# Altium project Mixed Signal Board Project.PrjPcb (part 2 of 2)
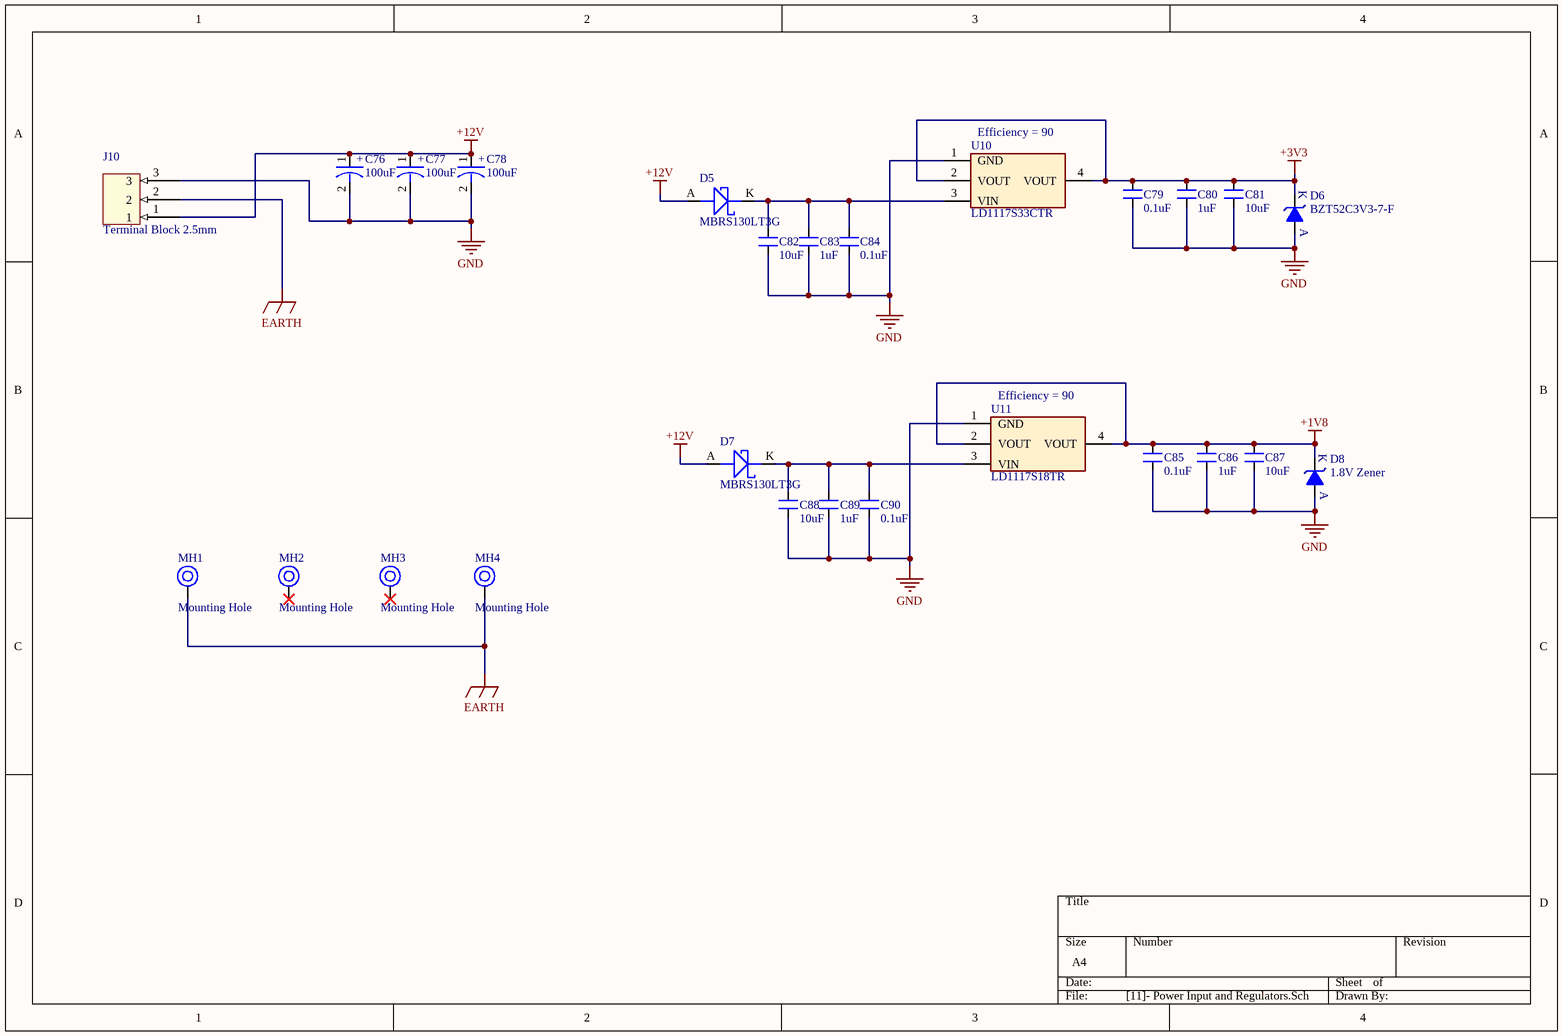
[diagram p11: [11]- Power Input and Regulators.SchDoc]

## Nets that join several sheets
+1V8: [8]-DAC and MIC (C36.2 C37.2 FB3.1 U6.34), [11]- Power Input and Regulators (6 pins)
+3V3: [3]- STM32F103 Debugger (14 pins), [4]- Ethernet PHY (10 pins), [5]- Motor Driver Schematic (R22.2), [6]-CH340C (C28.2 U4.4 U4.16), [7]- ADC Chip (8 pins), [8]-DAC and MIC (12 pins), [9]-STM32F407 Controller (20 pins), [10]-Motor Driver-2 (R43.2), [11]- Power Input and Regulators (6 pins)
+12V: [5]- Motor Driver Schematic (7 pins), [10]-Motor Driver-2 (6 pins), [11]- Power Input and Regulators (6 pins)
EARTH: [4]- Ethernet PHY (C21.2 R12.1), [11]- Power Input and Regulators (J10.2 MH1.1 MH4.1)
GND: [3]- STM32F103 Debugger (19 pins), [4]- Ethernet PHY (20 pins), [5]- Motor Driver Schematic (12 pins), [6]-CH340C (C28.1 J5.5 J5.6 U4.1), [7]- ADC Chip (10 pins), [8]-DAC and MIC (25 pins), [9]-STM32F407 Controller (28 pins), [10]-Motor Driver-2 (11 pins), [11]- Power Input and Regulators (20 pins)
CH340_RTS: [6]-CH340C (U4.14), [9]-STM32F407 Controller (U8.57)
CH340_RXD: [6]-CH340C (U4.3), [9]-STM32F407 Controller (U8.79)
CH340_TXD: [6]-CH340C (U4.2), [9]-STM32F407 Controller (U8.78)
CLK_MIC: [8]-DAC and MIC (U7.3), [9]-STM32F407 Controller (U8.65)
COL: [4]- Ethernet PHY (DS2.A U2.28), [9]-STM32F407 Controller (U8.26)
CRS: [4]- Ethernet PHY (DS1.A U2.29), [9]-STM32F407 Controller (U8.23)
DOUT_MIC: [8]-DAC and MIC (U7.4), [9]-STM32F407 Controller (U8.53)
DRDY: [7]- ADC Chip (U5.14), [9]-STM32F407 Controller (U8.56)
EN: [5]- Motor Driver Schematic (R23.1 U3.14), [9]-STM32F407 Controller (U8.45)
EN_2: [9]-STM32F407 Controller (U8.66), [10]-Motor Driver-2 (R44.1 U9.14)
JTCLK_F407: [3]- STM32F103 Debugger (U1.18), [9]-STM32F407 Controller (U8.76)
JTMS_F407: [3]- STM32F103 Debugger (U1.25 U1.27), [9]-STM32F407 Controller (U8.72)
LRCK: [8]-DAC and MIC (U6.40), [9]-STM32F407 Controller (U8.90)
MCLK: [8]-DAC and MIC (U6.37), [9]-STM32F407 Controller (U8.29)
MDC: [4]- Ethernet PHY (U2.12), [9]-STM32F407 Controller (U8.16)
MDIO: [4]- Ethernet PHY (R10.1 U2.11), [9]-STM32F407 Controller (U8.25)
nFAULT: [5]- Motor Driver Schematic (R21.1 U3.9), [9]-STM32F407 Controller (U8.62)
nFAULT_2: [9]-STM32F407 Controller (U8.59), [10]-Motor Driver-2 (R42.1 U9.9)
NTRST_F407: [3]- STM32F103 Debugger (U1.26), [9]-STM32F407 Controller (C55.2 R32.1 SW3.2 U8.14)
PH: [5]- Motor Driver Schematic (U3.15), [9]-STM32F407 Controller (U8.63)
PH_2: [9]-STM32F407 Controller (U8.60), [10]-Motor Driver-2 (U9.15)
PHY_RESET: [4]- Ethernet PHY (R7.1 SW2.2 U2.32), [9]-STM32F407 Controller (U8.64)
RESET: [7]- ADC Chip (R26.1 U5.3), [9]-STM32F407 Controller (U8.55)
RESET_DAC: [8]-DAC and MIC (R29.1 U6.32), [9]-STM32F407 Controller (U8.54)
RX_CLK: [4]- Ethernet PHY (U2.19), [9]-STM32F407 Controller (U8.24)
RX_D0: [4]- Ethernet PHY (U2.16), [9]-STM32F407 Controller (U8.33)
RX_D1: [4]- Ethernet PHY (U2.15), [9]-STM32F407 Controller (U8.34)
RX_D2: [4]- Ethernet PHY (U2.14), [9]-STM32F407 Controller (U8.35)
RX_D3: [4]- Ethernet PHY (U2.13), [9]-STM32F407 Controller (U8.36)
RX_DV: [4]- Ethernet PHY (U2.18), [9]-STM32F407 Controller (U8.32)
RX_ER: [4]- Ethernet PHY (U2.20), [9]-STM32F407 Controller (U8.47)
SCL: [7]- ADC Chip (R24.1 U5.16), [8]-DAC and MIC (U6.2), [9]-STM32F407 Controller (U8.92)
SCLK: [8]-DAC and MIC (U6.38), [9]-STM32F407 Controller (U8.89)
SDA: [7]- ADC Chip (R25.1 U5.15), [8]-DAC and MIC (U6.1), [9]-STM32F407 Controller (U8.93)
SDIN: [8]-DAC and MIC (U6.39), [9]-STM32F407 Controller (U8.80)
SNSOUT: [5]- Motor Driver Schematic (R20.1 U3.10), [9]-STM32F407 Controller (U8.61)
SNSOUT_2: [9]-STM32F407 Controller (U8.58), [10]-Motor Driver-2 (R41.1 U9.10)
SO: [5]- Motor Driver Schematic (U3.11), [9]-STM32F407 Controller (U8.30)
SO_2: [9]-STM32F407 Controller (U8.31), [10]-Motor Driver-2 (U9.11)
TX_CLK: [4]- Ethernet PHY (U2.22), [9]-STM32F407 Controller (U8.18)
TX_D0: [4]- Ethernet PHY (U2.24), [9]-STM32F407 Controller (U8.51)
TX_D1: [4]- Ethernet PHY (U2.25), [9]-STM32F407 Controller (U8.52)
TX_D2: [4]- Ethernet PHY (U2.26), [9]-STM32F407 Controller (U8.17)
TX_D3: [4]- Ethernet PHY (U2.27), [9]-STM32F407 Controller (U8.1)
TX_EN: [4]- Ethernet PHY (U2.23), [9]-STM32F407 Controller (U8.48)